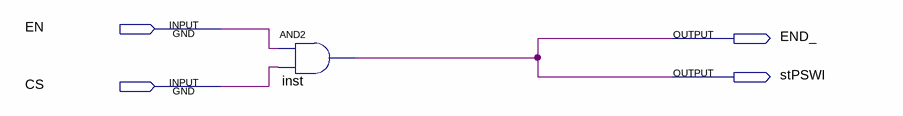
[diagram p0: schematic sheet]
// Quartus schematic SEI.bdf as structural Verilog: 1 symbols, 4 pins
module SEI (
  input  EN,
  input  CS,
  output END_,
  output stPSWI
);

  and inst (END_, EN, CS);

  assign stPSWI = END_;
endmodule
